# EAGLE design DoomsdayPCB (EAGLE 9.3.0)
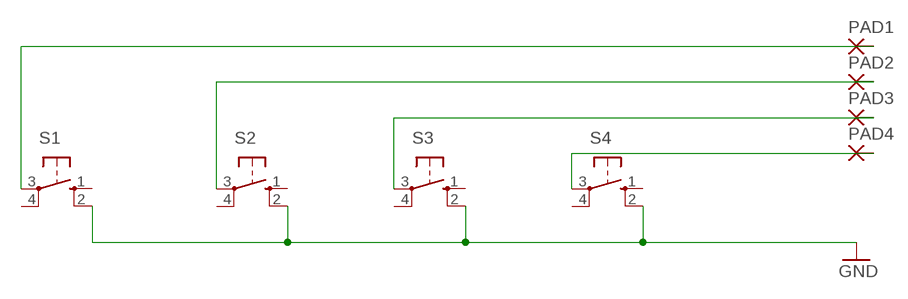
[diagram p0: schematic, sheet 1]

## Parts
PAD1  2,54/1,0  [2,54/1,0]
PAD2  2,54/1,0  [2,54/1,0]
PAD3  2,54/1,0  [2,54/1,0]
PAD4  2,54/1,0  [2,54/1,0]
S1  40-XX  [B3F-40XX]
S2  40-XX  [B3F-40XX]
S3  40-XX  [B3F-40XX]
S4  40-XX  [B3F-40XX]

## Nets
GND: S1.2(S1) S2.2(S1) S3.2(S1) S4.2(S1)
N$1: PAD2.1(P) S2.3(P)
N$2: PAD1.1(P) S1.3(P)
N$3: PAD3.1(P) S3.3(P)
N$4: PAD4.1(P) S4.3(P)
Unconnected: S1.1(S) S1.4(P1) S2.1(S) S2.4(P1) S3.1(S) S3.4(P1) S4.1(S) S4.4(P1)

## Library data of the parts
PAD1-PAD4 = wirepad:2,54/1,0: THROUGH-HOLE PAD
S1-S4 = switch-omron:40-XX: OMRON SWITCH; MF: OMRON COMPONENTS USA; MPN: B3F-4000; OC_FARNELL: 176434; OC_NEWARK: 36K3105

## Board
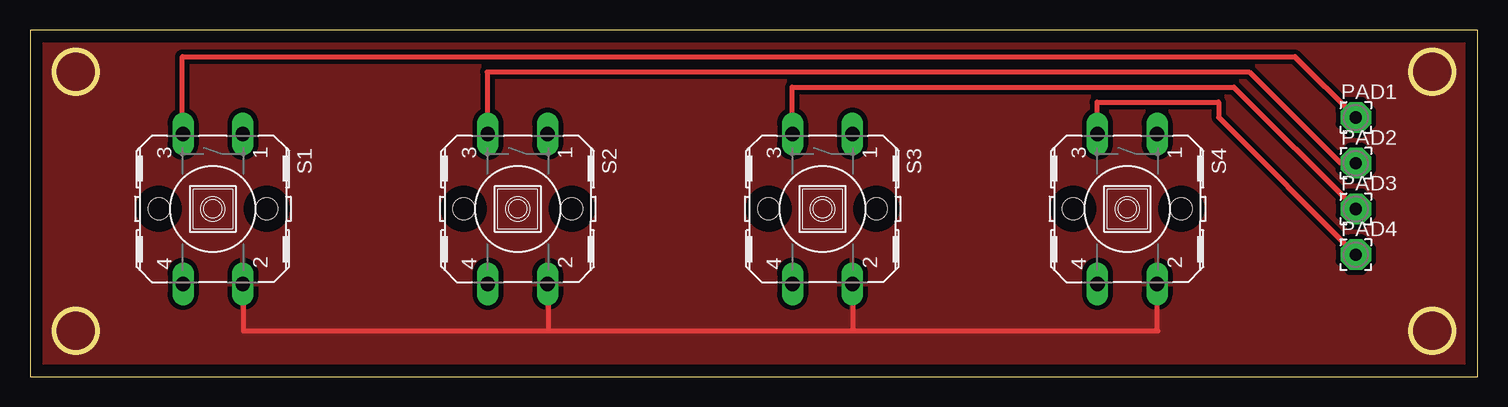
[diagram p1: board, top side]

Size 120.63 x 28.88 mm. Coordinates in mm from the lower left corner, seen from the top.
Outline: 0,0 120.63,0 120.63,28.88 0,28.88 0,0
Copper layers (1*16): Top 0.035mm / dielectric 1.5mm / Bottom 0.035mm
Design rules "default *": minimum track width 16mil, minimum drill 24mm, track to track 16mil, track to pad 16mil, pad to pad 16mil, via to via 16mil, smd to smd 16mil, copper to edge 40mil, drill to drill 6mil, minimum pad ring 10mil, minimum via ring 8mil, stop-mask expansion 4mil, vias tented up to drill 0mil, thermal gap 16mil
Milling: area 2,23.6 to 5.6,27.2; area 2,2 to 5.6,5.6; area 115,2 to 118.6,5.6; area 115,23.6 to 118.6,27.2

### Footprints (pad centres in the part's own frame; a part is rotated, then mirrored left to right if it is on the bottom)
2,54/1,0 = drill 1.016 pad 2.54 octagon: 1 0,0
B3F-40XX = drill 1.194 long: 1 -6.248,2.489; 2 6.248,2.489; 3 -6.248,-2.489; 4 6.248,-2.489 | hole 1.803: 0,-4.496; 0,4.496

### Placement (x,y rotation side)
PAD1  110.49,21.59 0 top
PAD2  110.49,17.78 0 top
PAD3  110.49,13.97 0 top
PAD4  110.49,10.16 0 top
S1  15.24,13.97 270 top
S2  40.64,13.97 270 top
S3  66.04,13.97 270 top
S4  91.44,13.97 270 top

### Tracks (layer width: path | path; a pad name or v marks a point on that pad's centre or on a via)
GND
  Top 0.406: S1.2 arc-90 17.78,7.67 17.78,3.81 43.18,3.81 | S4.2 93.93,3.86 arc90 93.98,3.81 68.58,3.81 | 43.18,3.81 68.58,3.81 | S3.2 arc-90 68.58,7.67 68.58,3.81 | S2.2 arc-90 43.18,7.67 43.18,3.81
  pour Top: 0,29.21 0,0 120.65,0 120.65,29.21
N$1
  Top 0.406: S2.3 38.15,25.35 38.1,25.4 101.6,25.4 109.22,17.78 PAD2.1
N$2
  Top 0.406: S1.3 arc-90 12.7,20.27 12.7,26.67 105.41,26.67 PAD1.1
N$3
  Top 0.406: S3.3 63.5,20.27 63.5,24.13 100.33,24.13 PAD3.1
N$4
  Top 0.406: S4.3 88.95,22.81 88.9,22.86 99.06,22.86 99.06,21.59 PAD4.1